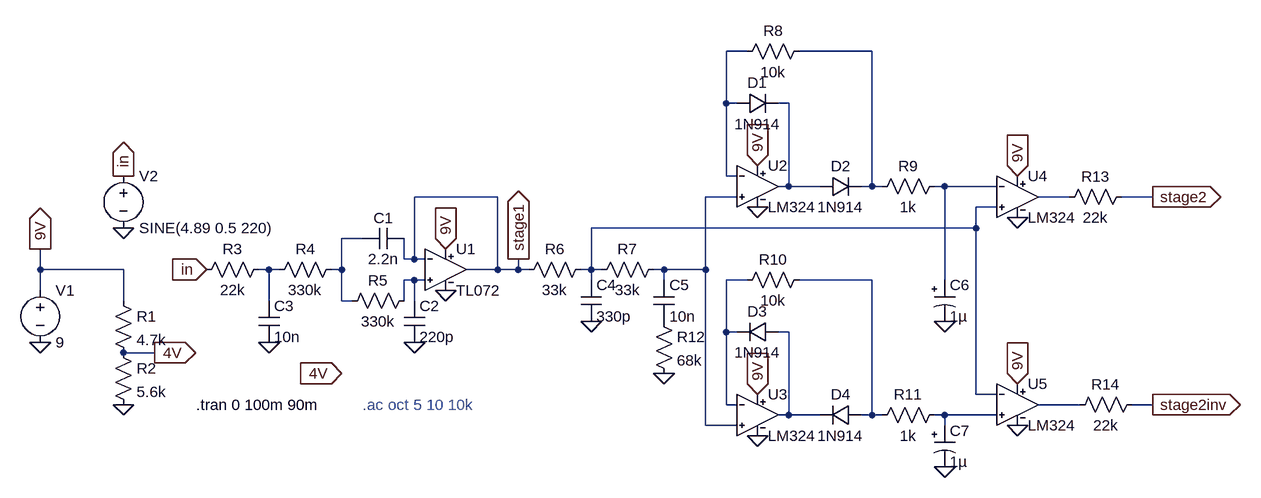
[diagram p0: schematic OC2-analyser-stage1.asc]
OC2-analyser-stage1.asc, the LTspice schematic file:
Version 4
SHEET 1 1608 680
WIRE 832 -16 800 -16
WIRE 1024 -16 912 -16
WIRE 800 64 800 -16
WIRE 816 64 800 64
WIRE 896 64 880 64
WIRE 800 176 800 64
WIRE 816 176 800 176
WIRE 896 192 896 64
WIRE 896 192 880 192
WIRE 944 192 896 192
WIRE 1024 192 1024 -16
WIRE 1024 192 1008 192
WIRE 1040 192 1024 192
WIRE 1136 192 1120 192
WIRE 1216 192 1136 192
WIRE 448 208 320 208
WIRE 816 208 768 208
WIRE 1328 208 1280 208
WIRE 1456 208 1408 208
WIRE 1216 224 1184 224
WIRE 1184 256 1184 224
WIRE 1184 256 592 256
WIRE 240 272 208 272
WIRE 304 304 304 272
WIRE 320 304 320 208
WIRE 320 304 304 304
WIRE 336 304 320 304
WIRE -256 320 -256 288
WIRE -128 320 -256 320
WIRE 96 320 80 320
WIRE 112 320 96 320
WIRE 208 320 208 272
WIRE 208 320 192 320
WIRE 448 320 448 208
WIRE 448 320 400 320
WIRE 480 320 480 304
WIRE 480 320 448 320
WIRE 496 320 480 320
WIRE 592 320 592 256
WIRE 592 320 576 320
WIRE 608 320 592 320
WIRE 704 320 688 320
WIRE 768 320 768 208
WIRE 768 320 704 320
WIRE 320 336 304 336
WIRE 336 336 320 336
WIRE 592 336 592 320
WIRE 704 336 704 320
WIRE 832 336 800 336
WIRE 1024 336 912 336
WIRE 1136 336 1136 192
WIRE -256 352 -256 320
WIRE -128 368 -128 320
WIRE 96 368 96 320
WIRE 208 368 208 320
WIRE 224 368 208 368
WIRE 304 368 304 336
WIRE 320 368 320 336
WIRE 800 416 800 336
WIRE 816 416 800 416
WIRE 896 416 880 416
WIRE -80 448 -128 448
WIRE 1184 512 1184 256
WIRE 1216 512 1184 512
WIRE 800 528 800 416
WIRE 816 528 800 528
WIRE 1344 528 1280 528
WIRE 1456 528 1424 528
WIRE 896 544 896 416
WIRE 896 544 880 544
WIRE 944 544 896 544
WIRE 1024 544 1024 336
WIRE 1024 544 1008 544
WIRE 1040 544 1024 544
WIRE 1136 544 1120 544
WIRE 1216 544 1136 544
WIRE 768 560 768 320
WIRE 816 560 768 560
WIRE 1136 560 1136 544
FLAG -128 528 0
FLAG -256 432 0
FLAG -256 288 9V
IOPIN -256 288 Out
FLAG -80 448 4V
IOPIN -80 448 Out
FLAG 368 352 0
FLAG 368 288 9V
IOPIN 368 288 In
FLAG 0 320 in
IOPIN 0 320 In
FLAG 208 480 4V
IOPIN 208 480 In
FLAG -128 256 0
FLAG -128 176 in
IOPIN -128 176 Out
FLAG 96 432 0
FLAG 320 432 0
FLAG 480 304 stage1
IOPIN 480 304 Out
FLAG 592 400 0
FLAG 848 576 0
FLAG 848 224 0
FLAG 848 512 9V
IOPIN 848 512 In
FLAG 848 160 9V
IOPIN 848 160 In
FLAG 1136 400 0
FLAG 1136 624 0
FLAG 1248 240 0
FLAG 1248 176 9V
IOPIN 1248 176 In
FLAG 1248 560 0
FLAG 1248 496 9V
IOPIN 1248 496 In
FLAG 704 480 0
FLAG 1456 208 stage2
IOPIN 1456 208 Out
FLAG 1456 528 stage2inv
IOPIN 1456 528 Out
SYMBOL TL072 368 256 R0
SYMATTR InstName U1
SYMBOL Voltage -256 336 R0
SYMATTR InstName V1
SYMATTR Value 9
SYMBOL Res -144 352 R0
SYMATTR InstName R1
SYMATTR Value 4.7k
SYMBOL Res -144 432 R0
SYMATTR InstName R2
SYMATTR Value 5.6k
SYMBOL Voltage -128 160 R0
SYMATTR InstName V2
SYMATTR Value SINE(4.89 0.5 220)
SYMATTR Value2 AC 0.5
SYMBOL Res 96 304 R90
WINDOW 0 0 56 VBottom 2
WINDOW 3 32 56 VTop 2
SYMATTR InstName R3
SYMATTR Value 22k
SYMBOL Res 208 304 R90
WINDOW 0 0 56 VBottom 2
WINDOW 3 32 56 VTop 2
SYMATTR InstName R4
SYMATTR Value 330k
SYMBOL Res 320 352 R90
WINDOW 0 0 56 VBottom 2
WINDOW 3 32 56 VTop 2
SYMATTR InstName R5
SYMATTR Value 330k
SYMBOL Cap 304 256 R90
WINDOW 0 0 32 VBottom 2
WINDOW 3 32 32 VTop 2
SYMATTR InstName C1
SYMATTR Value 2.2n
SYMBOL Cap 304 368 R0
SYMATTR InstName C2
SYMATTR Value 220p
SYMBOL Cap 80 368 R0
SYMATTR InstName C3
SYMATTR Value 10n
SYMBOL Res 592 304 R90
WINDOW 0 0 56 VBottom 2
WINDOW 3 32 56 VTop 2
SYMATTR InstName R6
SYMATTR Value 33k
SYMBOL Res 704 304 R90
WINDOW 0 0 56 VBottom 2
WINDOW 3 32 56 VTop 2
SYMATTR InstName R7
SYMATTR Value 33k
SYMBOL Cap 576 336 R0
SYMATTR InstName C4
SYMATTR Value 330p
SYMBOL LM324 848 128 R0
SYMATTR InstName U2
SYMBOL LM324 848 480 R0
SYMATTR InstName U3
SYMBOL Cap 688 336 R0
SYMATTR InstName C5
SYMATTR Value 10n
SYMBOL diode 816 80 R270
WINDOW 0 32 32 VTop 2
WINDOW 3 0 32 VBottom 2
SYMATTR InstName D1
SYMATTR Value 1N914
SYMBOL Res 928 -32 R90
WINDOW 0 0 56 VBottom 2
WINDOW 3 32 56 VTop 2
SYMATTR InstName R8
SYMATTR Value 10k
SYMBOL diode 944 208 R270
WINDOW 0 32 32 VTop 2
WINDOW 3 0 32 VBottom 2
SYMATTR InstName D2
SYMATTR Value 1N914
SYMBOL Res 1136 176 R90
WINDOW 0 0 56 VBottom 2
WINDOW 3 32 56 VTop 2
SYMATTR InstName R9
SYMATTR Value 1k
SYMBOL diode 880 400 R90
WINDOW 0 0 32 VBottom 2
WINDOW 3 32 32 VTop 2
SYMATTR InstName D3
SYMATTR Value 1N914
SYMBOL Res 928 320 R90
WINDOW 0 0 56 VBottom 2
WINDOW 3 32 56 VTop 2
SYMATTR InstName R10
SYMATTR Value 10k
SYMBOL diode 1008 528 R90
WINDOW 0 0 32 VBottom 2
WINDOW 3 32 32 VTop 2
SYMATTR InstName D4
SYMATTR Value 1N914
SYMBOL Res 1136 528 R90
WINDOW 0 0 56 VBottom 2
WINDOW 3 32 56 VTop 2
SYMATTR InstName R11
SYMATTR Value 1k
SYMBOL polcap 1120 336 R0
SYMATTR InstName C6
SYMATTR Value 1µ
SYMBOL polcap 1120 560 R0
SYMATTR InstName C7
SYMATTR Value 1µ
SYMBOL LM324 1248 144 R0
SYMATTR InstName U4
SYMBOL LM324 1248 464 R0
SYMATTR InstName U5
SYMBOL Res 688 384 R0
SYMATTR InstName R12
SYMATTR Value 68k
SYMBOL Res 1424 192 R90
WINDOW 0 0 56 VBottom 2
WINDOW 3 32 56 VTop 2
SYMATTR InstName R13
SYMATTR Value 22k
SYMBOL Res 1440 512 R90
WINDOW 0 0 56 VBottom 2
WINDOW 3 32 56 VTop 2
SYMATTR InstName R14
SYMATTR Value 22k
TEXT -16 528 Left 2 !.tran 0 100m 90m
TEXT 240 528 Left 2 ;.ac oct 5 10 10k

The netlist it stands for:
* OC2-analyser-stage1.asc
XU1 N010 stage1 9V 0 stage1 TL072  ; pins In+ In- V+ V- OUT
V1 9V 0 9
R1 9V 4V 4.7k
R2 4V 0 5.6k
V2 in 0 SINE(4.89 0.5 220) AC 0.5
R3 N009 in 22k
R4 N008 N009 330k
R5 N010 N008 330k
C1 stage1 N008 2.2n
C2 N010 0 220p
C3 N009 0 10n
R6 N007 stage1 33k
R7 N005 N007 33k
C4 N007 0 330p
XU2 N005 N001 9V 0 N003 LM324  ; pins In+ In- V+ V- OUT
XU3 N005 N011 9V 0 N013 LM324  ; pins In+ In- V+ V- OUT
C5 N005 P001 10n
D1 N001 N003 1N914
R8 N002 N001 10k
D2 N003 N002 1N914
R9 N004 N002 1k
D3 N013 N011 1N914
R10 N012 N011 10k
D4 N012 N013 1N914
R11 N015 N012 1k
C6 N004 0 1µ
C7 N015 0 1µ
XU4 N007 N004 9V 0 N006 LM324  ; pins In+ In- V+ V- OUT
XU5 N015 N007 9V 0 N014 LM324  ; pins In+ In- V+ V- OUT
R12 P001 0 68k
R13 stage2 N006 22k
R14 stage2inv N014 22k
.model D D
.lib standard.dio
.tran 0 100m 90m
* .ac oct 5 10 10k
.lib TL072.sub
.lib LM324.sub
.backanno
.end